# EAGLE design afb_r005_revb (EAGLE 9.6.2)
AUTHOR: Wes B; REV: 3R1

## Sheet 1 of 2
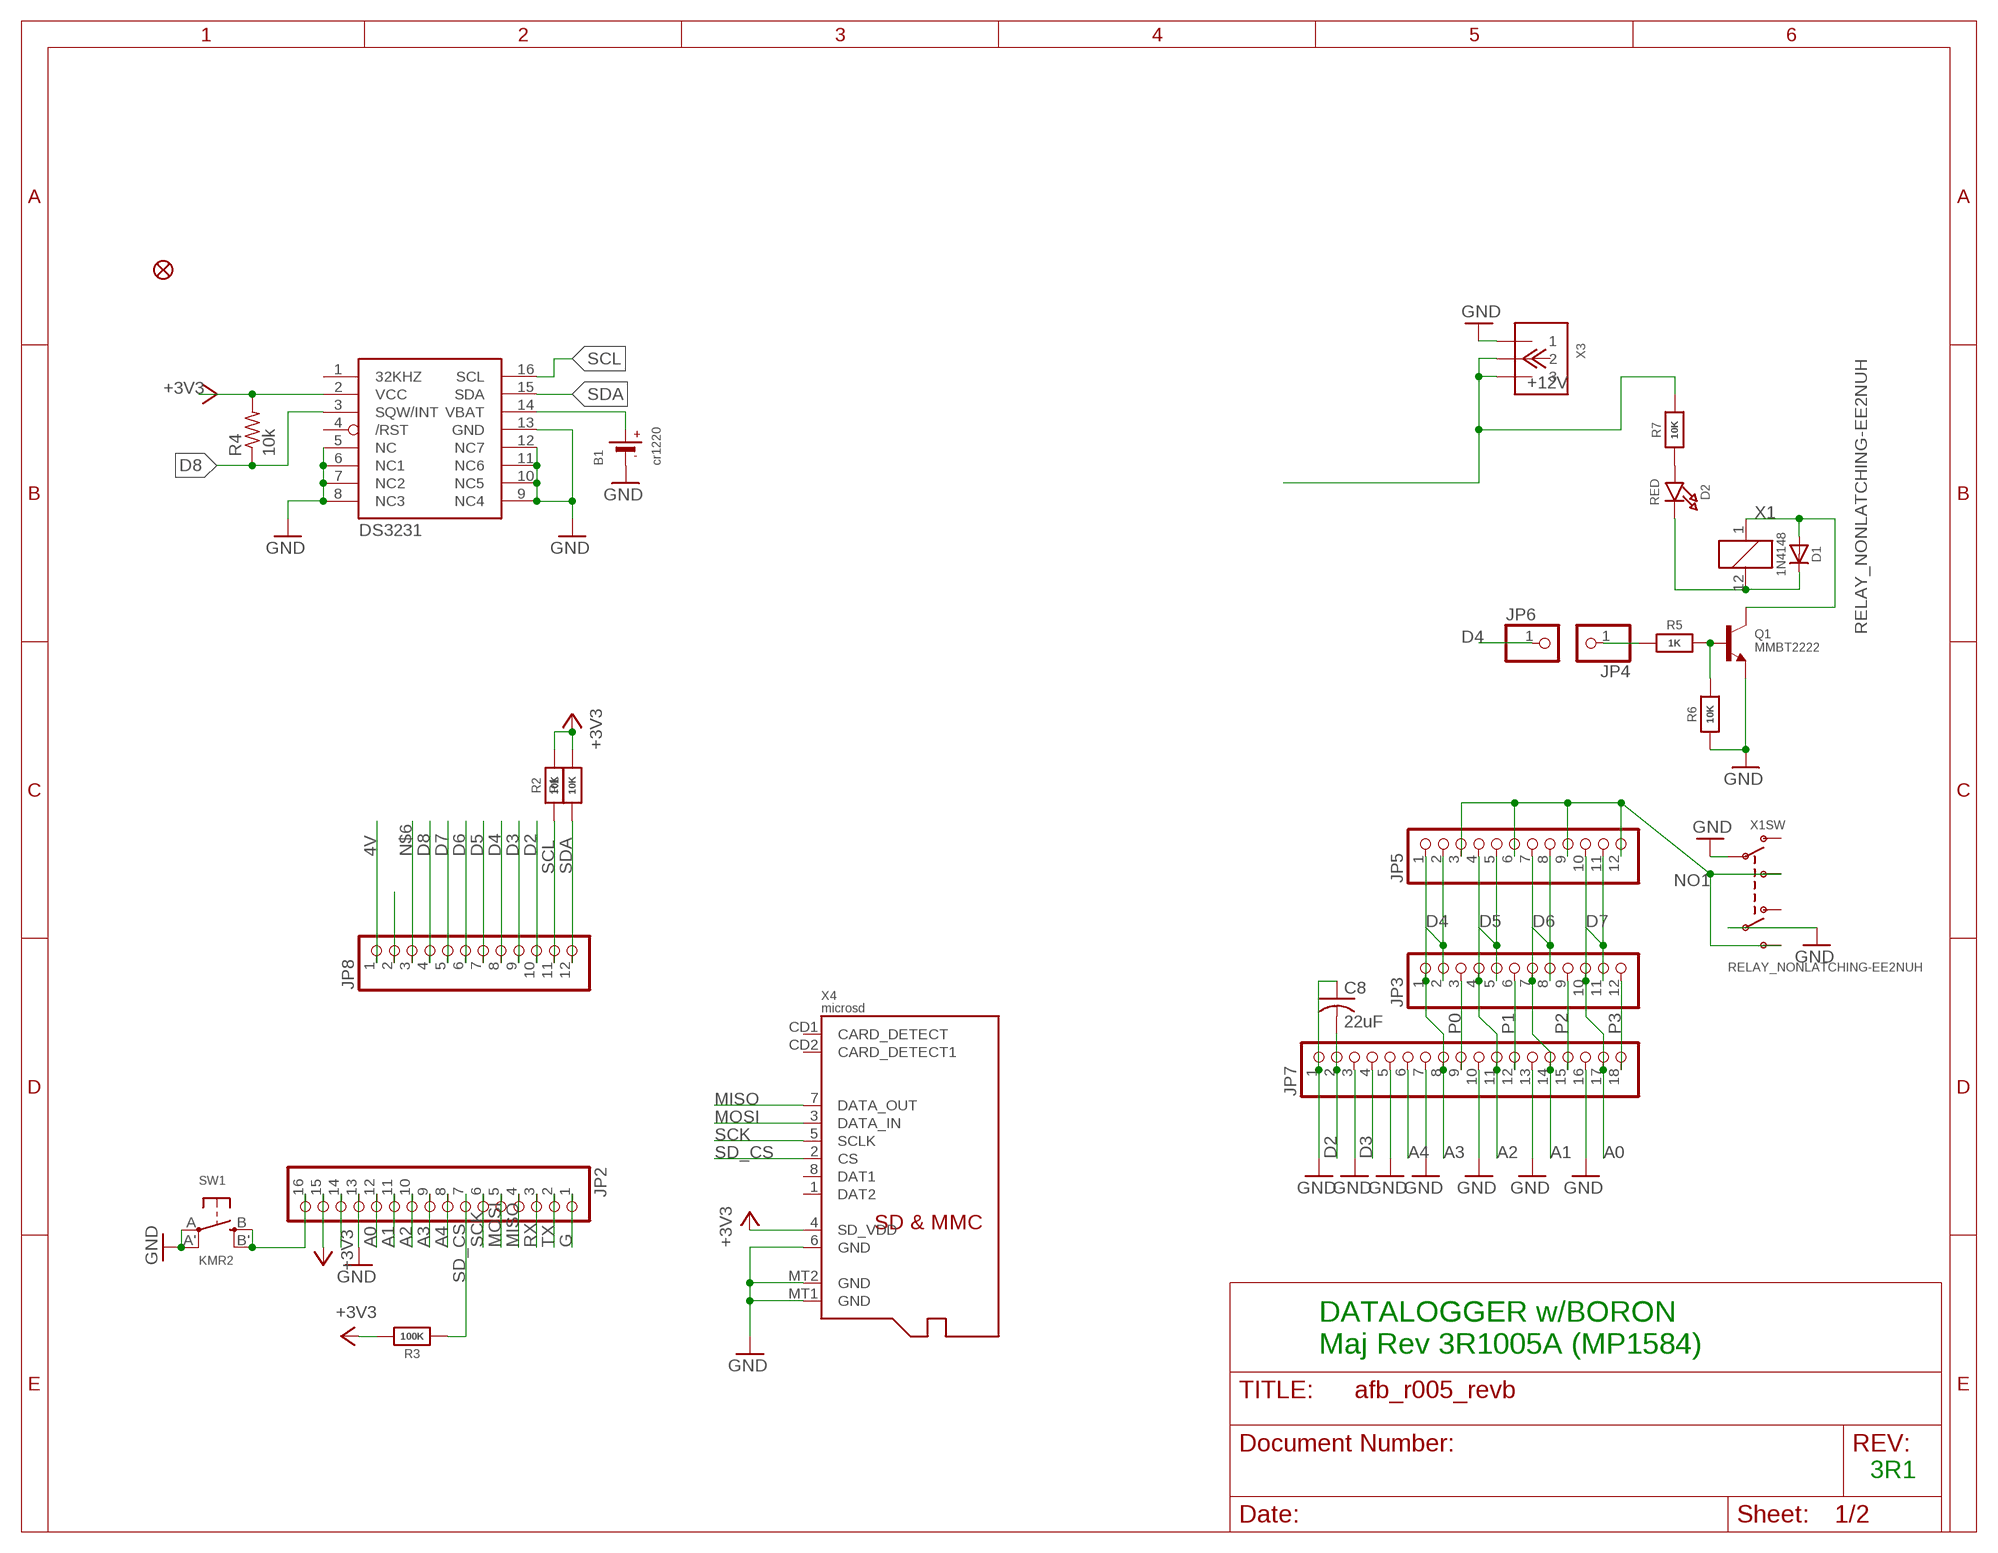
[diagram p0: schematic, sheet 1]

### Parts
B1  cr1220  BATTERYCR1220_2  [CR1220-2]
C8  22uF  C-USC0805  [C0805]
D1  1N4148  DIODESOD-323  [SOD-323]
D2  RED  LED0805_NOOUTLINE  [CHIPLED_0805_NOOUTLINE]
FID1  FIDUCIAL_1MM  [FIDUCIAL_1MM]
IC2  DS3231/SO  [SO16W]
JP2  HEADER-1X16ROUND  [1X16_ROUND]
JP3  PINHD-1X12-CB  [1X12-CB]
JP4  HEADER-1X1ROUND  [1X01_ROUND]
JP5  PINHD-1X12-CB  [1X12-CB]
JP6  HEADER-1X1ROUND  [1X01_ROUND]
JP7  PINHD-1X18  [1X18]
JP8  PINHD-1X12-CB  [1X12-CB]
Q1  MMBT2222  TRANSISTOR_NPN  [SOT23-R]
R1  10K  RESISTOR_0603_NOOUT  [0603-NO]
R2  10K  RESISTOR_0603_NOOUT  [0603-NO]
R3  100K  RESISTOR_0603_NOOUT  [0603-NO]
R4  10k  R-US_R0805  [R0805]
R5  1K  RESISTOR0805_NOOUTLINE  [0805-NO]
R6  10K  RESISTOR0805_NOOUTLINE  [0805-NO]
R7  10K  RESISTOR0805_NOOUTLINE  [0805-NO]
SW1  KMR2  SWITCH_TACT_SMT4.6X2.8  [BTN_KMR2_4.6X2.8]
X1  RELAY_NONLATCHING-EE2NUH  [RELAY_EE2_NOLATCH]
X3  TERMBLOCK_1X3  [TERMBLOCK_1X3-3.5MM]
X4  microsd  MICROSD  [MICROSD]

### Nets
4V: JP8.1 ; also sheet 2
+3V3: IC2.2(VCC) JP2.15 R1.2 R2.2 R3.2 R4.2 X4.4(SD_VDD)
A0: JP2.12 JP3.10 JP5.10 JP7.17
A1: JP2.11 JP3.7 JP5.7 JP7.14
A2: JP2.10 JP3.4 JP5.4 JP7.11
A3: JP2.9 JP3.1 JP5.1 JP7.8
A4: JP2.8 JP7.6
AREF: JP2.14
D2: C8.2 JP7.2 JP8.10
D3: JP7.4 JP8.9
D4: JP3.2 JP5.2 JP6.1 JP8.8
D5: JP3.5 JP5.5 JP8.7
D6: JP3.8 JP5.8 JP8.6
D7: JP3.11 JP5.11 JP8.5
D8: IC2.3(SQW/INT) JP8.4 R4.1
G: JP2.1
GND: B1.- C8.1 IC2.5(NC) IC2.6(NC1) IC2.7(NC2) IC2.8(NC3) IC2.9(NC4) IC2.10(NC5) IC2.11(NC6) IC2.12(NC7) IC2.13(GND) JP2.13 JP7.1 JP7.3 JP7.5 JP7.7 JP7.10 JP7.13 JP7.16 Q1.2(E) R6.1 SW1.A'(P1) SW1.A(P) X1.4(SW:P2) X1.9(SW:P1) X3.1 X4.6(GND) X4.MT1(GND) X4.MT2(GND) ; also sheet 2
MISO: JP2.4 X4.7(DATA_OUT)
MOSI: JP2.5 X4.3(DATA_IN)
N$1: B1.+ IC2.14(VBAT)
N$2: D1.A Q1.3(C) X1.1
N$6: JP8.3
N$7: JP8.2
N$11: D1.C D2.C X1.12
N$22: Q1.1(B) R5.2 R6.2
N$24: JP4.1 R5.1
N$26: D2.A R7.1
NO1 [HV]: JP5.3 JP5.6 JP5.9 JP5.12 X1.5(SW:S2) X1.8(SW:S1)
P0: JP3.3 JP7.9
P1: JP3.6 JP7.12
P2: JP3.9 JP7.15
P3: JP3.12 JP7.18
RESET: JP2.16 SW1.B'(S1) SW1.B(S)
RX: JP2.3
SCK: JP2.6 X4.5(SCLK)
SCL: IC2.16(SCL) JP8.11 R2.1
SD_CS: JP2.7 R3.1 X4.2(CS)
SDA: IC2.15(SDA) JP8.12 R1.1
TX: JP2.2
VIN: R7.2 X3.2 X3.3 ; also sheet 2
Unconnected: IC2.1(32KHZ) IC2.4(/RST) X1.3(SW:O2) X1.10(SW:O1) X4.1(DAT2) X4.8(DAT1) X4.CD1(CARD_DETECT) X4.CD2(CARD_DETECT1)

### Notes on the sheet
- DATALOGGER w/BORON
  Maj Rev 3R1005A (MP1584)
- 3R1

## Sheet 2 of 2
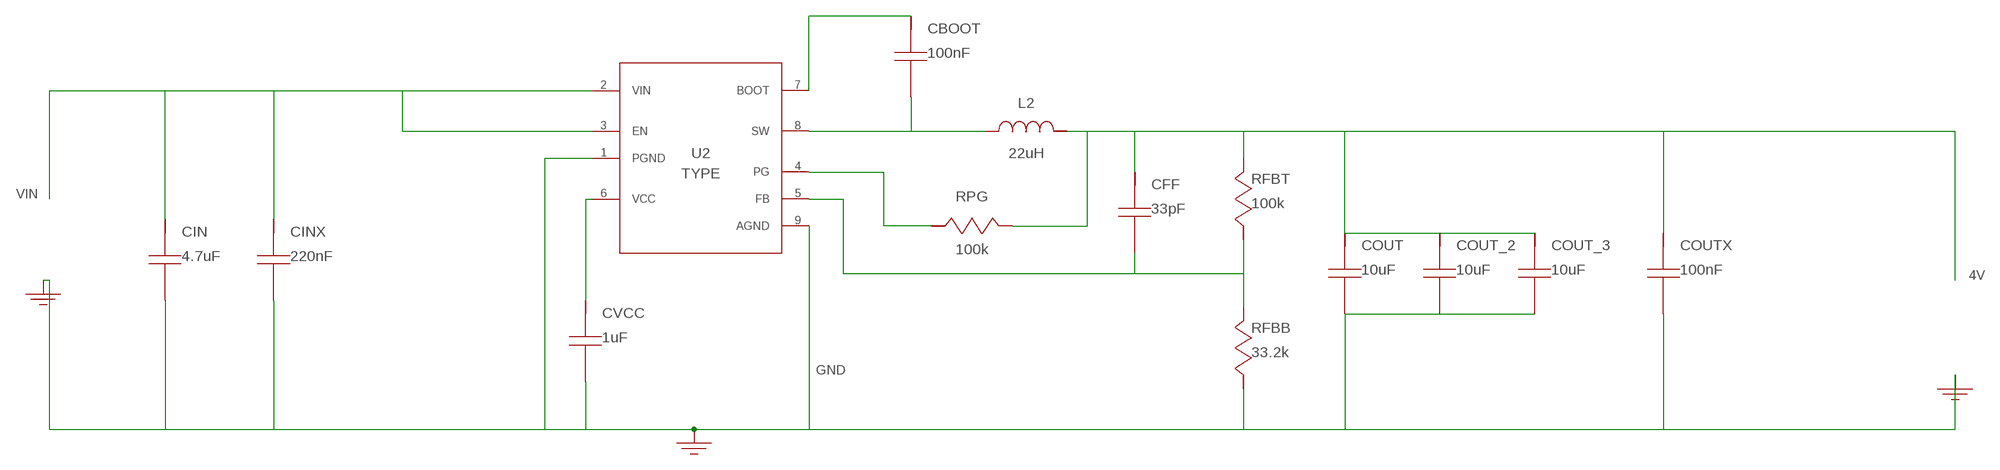
[diagram p1: schematic, sheet 2]

### Parts
CBOOT  100nF  GRM155R71C104KA88D  [0402]
CFF  33pF  CGA1A2C0G1E330J030BA  [0201]
CIN  4.7uF  GRM31CR71H475KA12L  [1206]
CINX  220nF  C2012X7R1H224K125AA  [0805]
COUT  10uF  GRM31CR60J106KA01L  [1206_190]
COUT_2  10uF  GRM31CR60J106KA01L  [1206_190]
COUT_3  10uF  GRM31CR60J106KA01L  [1206_190]
COUTX  100nF  GRM188R71C104KA01D  [0603]
CVCC  1uF  C0603C105K8PACTU  [0603]
GND  WB_GND  WB_GNDWB_GND  [WB_GND]
GND9  WB_GND  WB_GNDWB_GND  [WB_GND]
GND10  WB_GND  WB_GNDWB_GND  [WB_GND]
L2  22uH  MSS1210-223MEB  [MSS1210]
RFBB  33.2k  CRCW040233K2FKED  [0402]
RFBT  100k  CRCW0402100KFKED  [0402]
RPG  100k  CRCW0402100KFKED  [0402]
U2  Value  LMR33610ADDAR  [DDA0008J]

### Nets
4V: CFF.1 COUT.1 COUT_2.1 COUT_3.1 COUTX.1 L2.2 RFBT.1 RPG.1 ; also sheet 1
BS: CBOOT.1 U2.7(BOOT)
FB: CFF.2 RFBB.1 RFBT.2 U2.5(FB)
GND: CIN.2 CINX.2 COUT.2 COUT_2.2 COUT_3.2 COUTX.2 CVCC.2 GND9.1 GND10.1 GND.1 RFBB.2 U2.1(PGND) U2.9(AGND) ; also sheet 1
RB2: RPG.2 U2.4(PG)
VCC: CVCC.1 U2.6(VCC)
VIN: CIN.1 CINX.1 U2.2(VIN) U2.3(EN) ; also sheet 1
VSW: CBOOT.2 L2.1 U2.8(SW)

## Library data of the parts
B1 = microbuilder:BATTERY: CR1220 SMT - Digikey: 3001K-ND CD2032 BAT-HLD-001 - Digikey: BAT-HLD-001-ND
C8 = adafruit:C-US: CAPACITOR, American symbol
CBOOT = AcceleratedDesigns_Lib:GRM155R71C104KA88D; CAP: 1.0E7; ESR: 0.0; IRMS: 0.0; MANUFACTURER_NAME: MuRata; MANUFACTURER_PART_NUMBER: GRM155R71C104KA88D; VDC: 16.0; VENDOR: MuRata
CFF = AcceleratedDesigns_Lib:CGA1A2C0G1E330J030BA; CAP: 3.3E11; DATASHEETURL: httpproduct.tdk.comcapacitormlccendocumentsmlcc%5Fautomotive%5Fgeneral%5Fen.pdf; ESR: 0.0; IRMS: 0.0; MANUFACTURER_NAME: TDK; MANUFACTURER_PART_NUMBER: CGA1A2C0G1E330J030BA; VDC: 25.0; VENDOR: TDK
CIN = AcceleratedDesigns_Lib:GRM31CR71H475KA12L; CAP: 4.7E6; ESR: 0.0; IRMS: 0.0; MANUFACTURER_NAME: MuRata; MANUFACTURER_PART_NUMBER: GRM31CR71H475KA12L; VDC: 50.0; VENDOR: MuRata
CINX = AcceleratedDesigns_Lib:C2012X7R1H224K125AA; CAP: 2.2E7; DATASHEETURL: httpsproduct.tdk.comensearchcapacitorceramicmlccinfo?part%5Fno%3DC2012X7R1H224K125AA; ESR: 0.016949; IRMS: 1.59611; MANUFACTURER_NAME: TDK; MANUFACTURER_PART_NUMBER: C2012X7R1H224K125AA; VDC: 50.0; VENDOR: TDK
COUT COUT_2 COUT_3 = AcceleratedDesigns_Lib:GRM31CR60J106KA01L; CAP: 1.0E5; ESR: 0.0; IRMS: 0.0; MANUFACTURER_NAME: MuRata; MANUFACTURER_PART_NUMBER: GRM31CR60J106KA01L; VDC: 6.3; VENDOR: MuRata
COUTX = AcceleratedDesigns_Lib:GRM188R71C104KA01D; CAP: 1.0E7; ESR: 0.0; IRMS: 0.0; MANUFACTURER_NAME: MuRata; MANUFACTURER_PART_NUMBER: GRM188R71C104KA01D; VDC: 16.0; VENDOR: MuRata
CVCC = AcceleratedDesigns_Lib:C0603C105K8PACTU; CAP: 1.0E6; ESR: 0.0; IRMS: 0.0; MANUFACTURER_NAME: Kemet; MANUFACTURER_PART_NUMBER: C0603C105K8PACTU; VDC: 10.0; VENDOR: Kemet
D1 = microbuilder:DIODE: Diode SMA Model Volts Amps Type Vf Ir Digikey # Notes SSA34-E3 40V 3A Schottky 480mV @ 3A 200uA @ 40V SSA34-E3/61TGITR-ND CDBA120-G 20V 1A Schottky 500mV @ 1A 500uA @ 20V 641-1014-6-ND REEL MBRA210 10V 2A Schottky 350mV @ 2A 700uA @ 10V MBRA210LT3 SOD-123 Model Volts Amps Type Vf Ir Order # Notes BAT54T1G 30V 200mA Schottky 800mV @ 200mA 2uA @ 25V BAT54T1GOSTR-ND B0530W 30V 500mA Schottky 430mV @ 500mA 130uA @ 30V B0530W-FDICT-ND REEL MBR120 20V 1A Schottky 340mV @ 1A MBR120VLSFT1GOSCT-ND SOD-323 Model Volts Amps Type Vf Ir Order # Notes PMEG2005EJ 20V 500mA Schottky 355mV @ 500mA 568-4110-1-ND ZLLS410 10V 570mA Schottky 380mV @ 570mA ZLLS410CT-ND 1N4148WS 75V 150mA Silicon/Simple 1V 1N4148WSFSCT-ND REEL SOD-523 Model Volts Amps Type Vf Ir Order # Notes BAT54XV2 30V 200mA Schottky 0.8V @ 100mA BAT54XV2CT-ND TB751S 30V 30mA Schottky RB751S-40TE61CT-ND SOT23-R/W (R = Solder Paste/Reflow Ovens, W = Hand-Soldering) Model Volts Amps Type Vf Ir Order # Notes BAT54FILM 40V 300mA Schottky 497-7162-1-ND POWERDI-5 Model Volts Amps Type Vf Ir Order # Notes PDS560 60V 5A Schottky 670mV @ 5A 150uA @ 60V PDS560DICT-ND
D2 = microbuilder:LED: LED 0603 - 0603 Surface Mount Package 2mA: Green LED - Low Power (3.9mcd, 2ma, 1.7Vf) - Digikey: 475-2709-2-ND Orange LED - Low Power (9.8mcd, 2ma, 1.8Vf) - Digikey: 475-1194-2-ND Red LED - Low Power (5mcd, 2ma, 1.8Vf) - Digikey: 475-1195-2-ND Yellow LED - Low Power (7mcd, 2ma, 1.8Vf) - Digikey: 475-1196-2-ND 5mA: Blue LED - Low Power (17mcd, 5ma, 2.9Vf) - Digikey: LNJ937W8CRACT-ND 0805 - 0805 Surface Mount Package 2mA: Red LED (8.8mcd, 2mA, 1.8Vf, Clear) - Low Power [Digikey: 475-2510-1-ND] Green LED (5mcd, 2mA, 1.8Vf, Clear) - Low Power [Digikey: 475-2730-1-ND] Yellow LED (11.3mcd, 2mA, 1.8Vf, Clear) - Low Power [Digikey: 475-2555-1-ND] 20mA: Red LED (104mcd, 20mA, Diffused) - LS R976 [Digikey: 475-1278-6-ND] Red LED (12mcd, 20mA, 2.0Vf, Clear) - APT2012EC [Digikey: 754-1128-1-ND] Green LED (15mcd, 20mA, 2.2Vf, Clear) - APT2012GC [Digikey: 754-1131-1-ND] Orange LED (160mcd, 20mA, 2.1Vf, Clear) - APT2012SECK [Digikey: 754-1130-1-ND] 1206 - 1206 Surface Mount Package Green LED (26mcd, 20mA, Diffused) - LG N971 [Digikey: 475-1407-6-ND] Red LED (15mcd, 20mA, Diffused) - LH N974 [Digikey: 475-1416-6-ND] Cree - Cree High-Power Surface Mount LEDs XPEBWT-L1-0000-00D50 - White 111lm 350mA 2.9Vf 6200K 110° XTEAWT-00-0000-00000LEE3 - White 114lm 350mA 2.85Vf 5000K 115° Everlight - Everlight 45-21 Series Surface Mount LEDs 45-21/QK2C-B2832AC2CB2/2T - Warm White 2000mcd 20mA 3.25Vf 3050K 120° 45-21/LK2C-B38452C4CB2/2T - Nuetral White 2000mcd 20mA 3.25Vf 4150K 120° 45-21/LK2C-B50634C6CB2/2T - Cold White 2200mcd 20mA 3.25Vf 5650K 120° PLCC2 Reverse Mount LS T77K-J1L2-1-0-2-R18-Z - Red 11.25mcd 2mA 1.8Vf 630nm 120° LO T77K-L1M2-24-Z - Orange 19.6mcd 2mA 1.8Vf 606nm 120° LY T77K-K2M1-26-Z - Yellow 15.7mcd 2mA 1.8Vf 587nm 120°
FID1 = microbuilder:FIDUCIAL: Fiducial Alignment Points Various fiducial points for machine vision alignment.; BOM: EXCLUDE
GND GND9 GND10 = AcceleratedDesigns_Lib:WB_GND; MANUFACTURER_NAME: WB_GND; MANUFACTURER_PART_NUMBER: WB_GND; POWERPORTTYPE: POWER_GROUND; VALUE: Value
IC2 = DS3231:DS3231; AVAILABILITY: Unavailable; DESCRIPTION: Real Time Clock (RTC) IC Clock/Calendar I²C, 2-Wire Serial 16-SOIC (0.295, 7.50mm Width); MF: Maxim Integrated; MP: DS3231; PACKAGE: SOIC-16 Maxim Integrated; PRICE: None
JP2 = microbuilder:HEADER-1X16: PIN HEADER
JP3 JP5 JP8 = adafruit:PINHD-1X12: PIN HEADER
JP4 JP6 = microbuilder:HEADER-1X1: PIN HEADER
JP7 = adafruit:PINHD-1X18: PIN HEADER
L2 = AcceleratedDesigns_Lib:MSS1210-223MEB; DATASHEETURL: httpwww.coilcraft.compdfsmss1210.pdf; DCR: 0.026; DESCRIPTION: Unknown; IDC: 6.7; L: 2.2E5; MANUFACTURER: CoilCraft; MANUFACTURER_NAME: Coilcraft; MANUFACTURER_PART_NUMBER: MSS1210223MEB; PACKAGE_DESIGNATOR: MSS1210; VENDOR: Coilcraft
Q1 = microbuilder:TRANSISTOR_NPN: NPN Transistor Transistor (NPN) 500mA 45V - BC817 [Digikey: 568-1631-1-ND] Transistor (NPN) 500mA 45V - BC817,215 [Mouser: 771-BC817-T/R] SOT23-R - SOT23 footprint optimised for use with solder paste and reflow ovens. SOT23-W - SOT23 footprint optimised for hand-soldering (larger pads).
R1-R3 R5-R7 = microbuilder:RESISTOR: Resistors For new designs, use the packages preceded by an '_' character since they are more reliable: The following footprints should be used on most boards: _0402 - Standard footprint for regular board layouts _0603 - Standard footprint for regular board layouts _0805 - Standard footprint for regular board layouts _1206 - Standard footprint for regular board layouts For extremely tight-pitch boards where space is at a premium, the following 'micro-pitch' footprints can be used (smaller pads, no silkscreen outline, etc.): _0402MP - Micro-pitch footprint for very dense/compact boards _0603MP - Micro-pitch footprint for very dense/compact boards _0805MP - Micro-pitch footprint for very dense/compact boards _1206MP - Micro-pitch footprint for very dense/compact boards
R4 = adafruit:R-US_: RESISTOR, American symbol
RFBB = AcceleratedDesigns_Lib:CRCW040233K2FKED; MANUFACTURER_NAME: VishayDale; MANUFACTURER_PART_NUMBER: CRCW040233K2FKED; POWER: 0.063; RESISTANCE: 33200.0; TOLERANCE: 1.0; VENDOR: VishayDale
RFBT RPG = AcceleratedDesigns_Lib:CRCW0402100KFKED; MANUFACTURER_NAME: VishayDale; MANUFACTURER_PART_NUMBER: CRCW0402100KFKED; POWER: 0.063; RESISTANCE: 100000.0; TOLERANCE: 1.0; VENDOR: VishayDale
SW1 = microbuilder:SWITCH_TACT_SMT: SMT Tact Switches 6x6mm - Digikey: P12940SCT-ND KMR2 (4.6x2.8mm) - Digikey: 401-1426-1-ND EVQ-PQHB55 - Light Touch, 160GF (4.5x4.5mm) - Digikey: P8090SCT-ND KMT0 - KMT021 NGJ LHS (etc.) IP68/Waterproof - Digikey: CKN10289CT-ND
U2 = AcceleratedDesigns_Lib:LMR33610ADDAR; MANUFACTURER: Texas Instruments; MANUFACTURER_NAME: Texas Instruments; MANUFACTURER_PART_NUMBER: LMR33610ADDAR; PARTNUMBER: LMR33610ADDAR; REFDES: RefDes; TYPE: TYPE
X1 = microbuilder:RELAY_NONLATCHING
X3 = microbuilder:TERMBLOCK_1X3: 3.5mm Terminal block http://www.ladyada.net/library/pcb/eaglelibrary.html
X4 = microbuilder:MICROSD: MicroSD/Transflash Card Holder with SPI pinout 3M: 2908-05WB-MG 4UConnector: 19656 Footprint courtesy: Adafruit Industries

## Net classes
1 HV: width 0.406 mm, drill 0.381 mm, clearance 1.016 mm

## Board
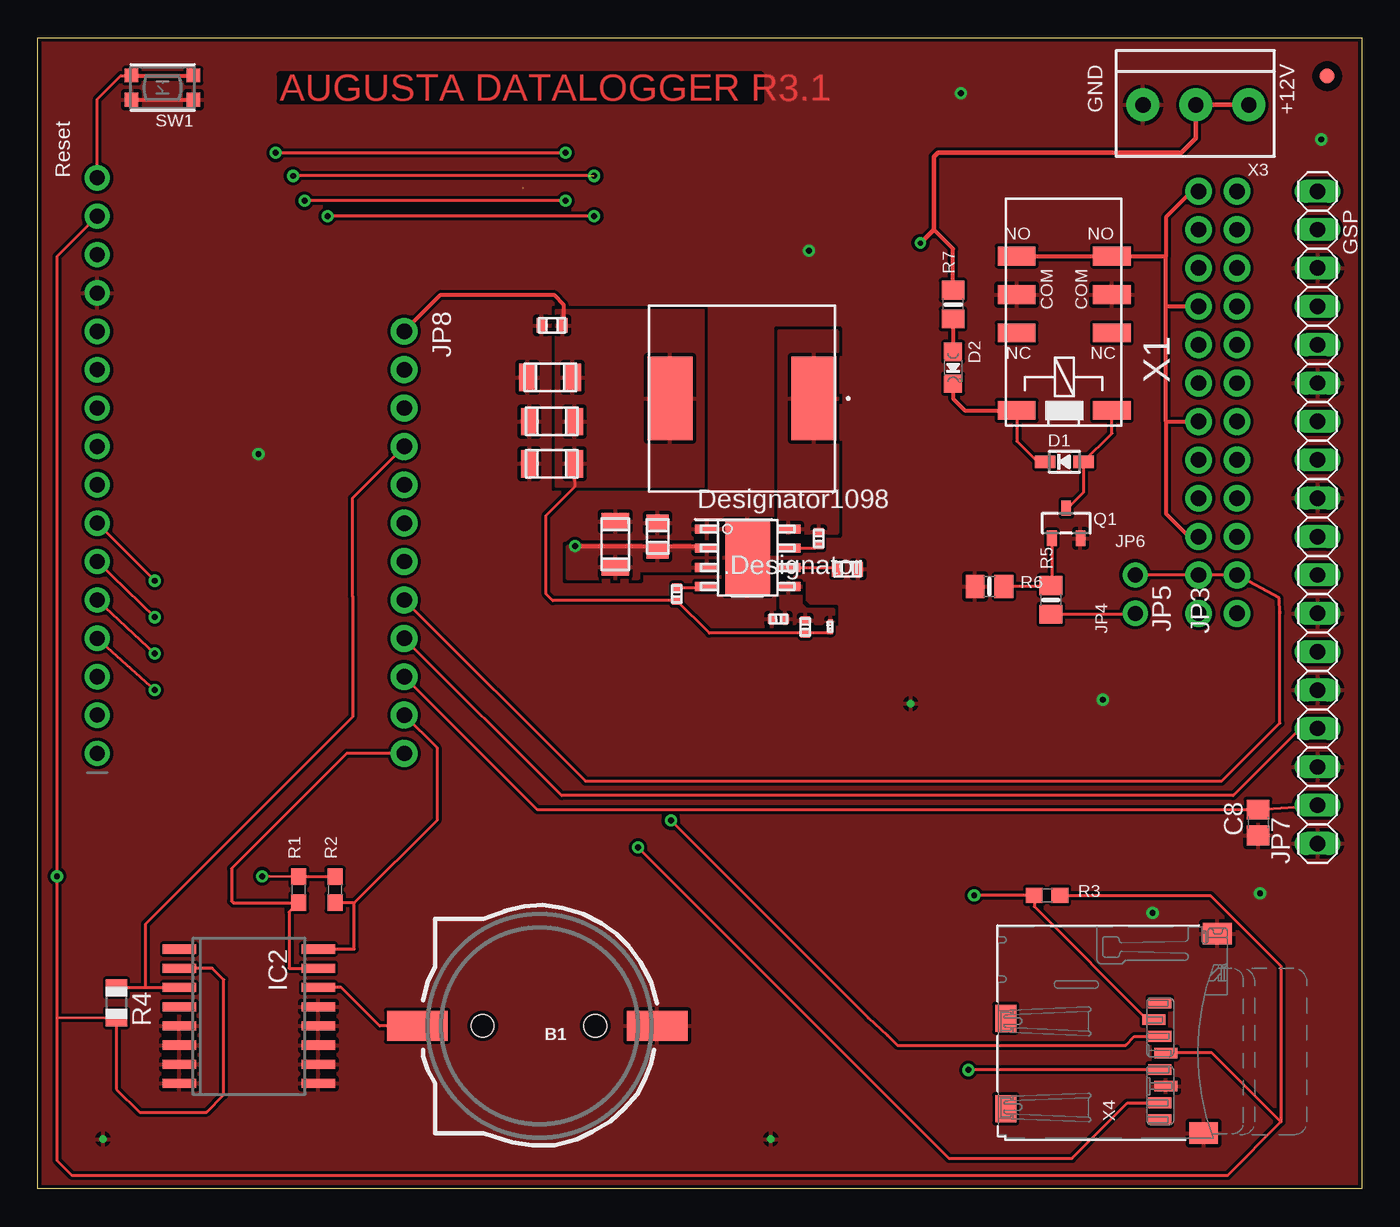
[diagram p2: board, top side]
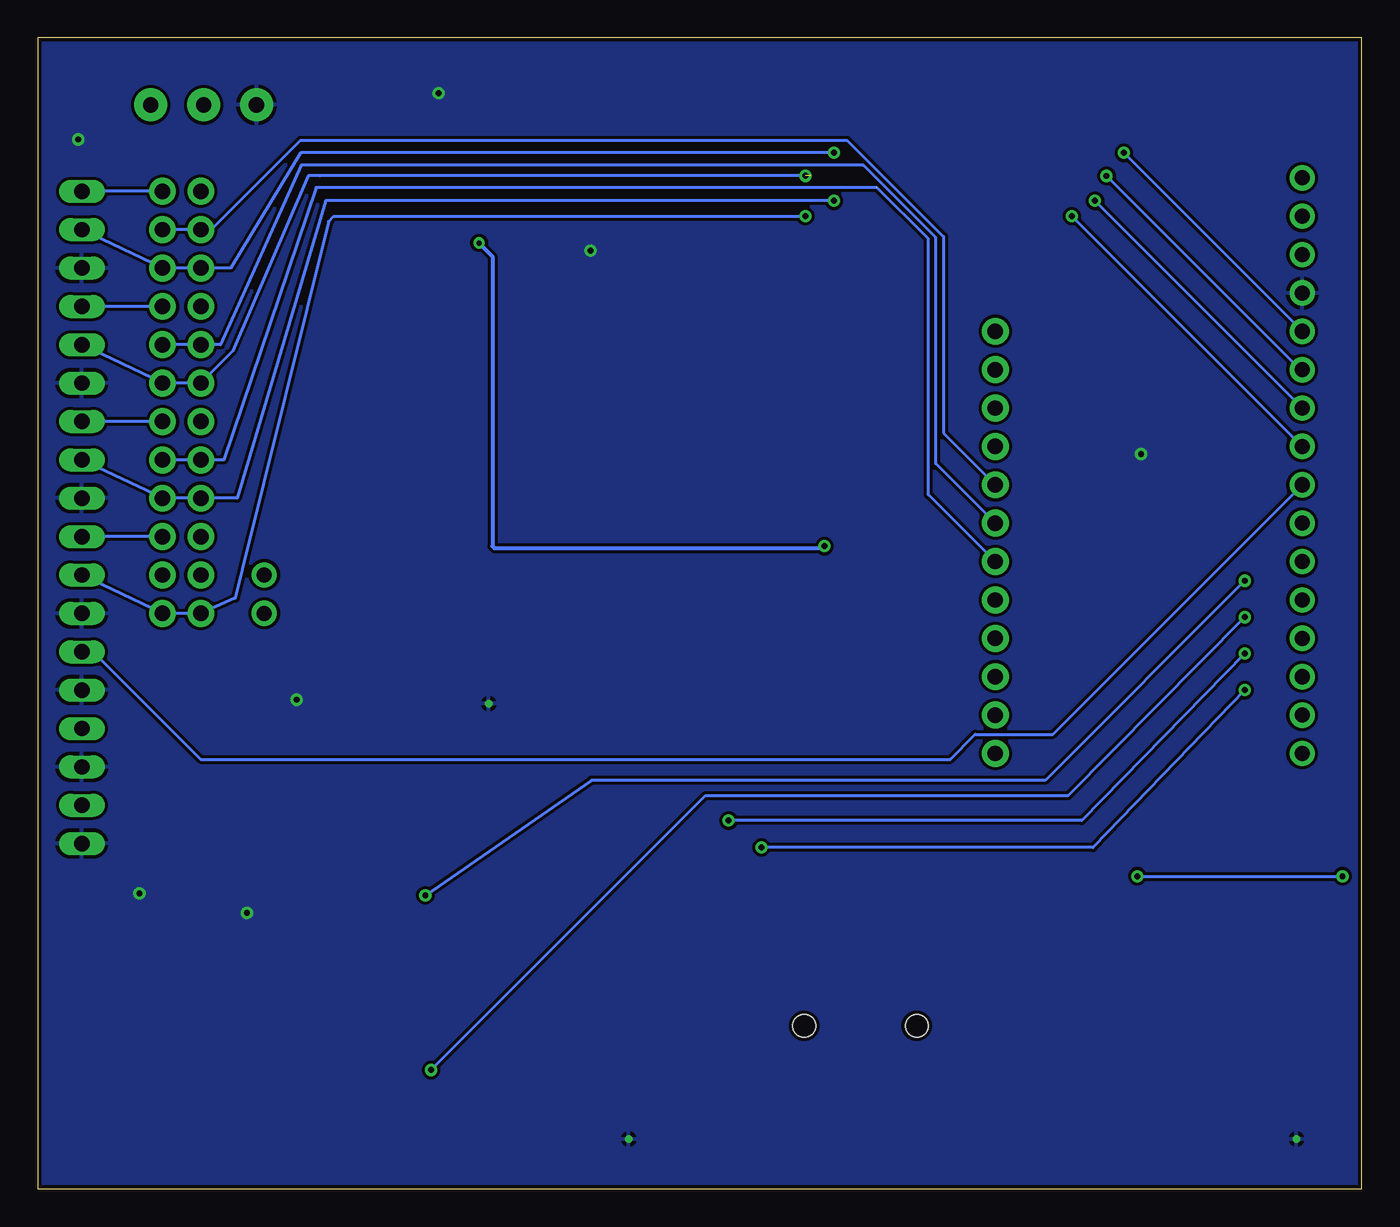
[diagram p3: board, bottom side, seen from below]

Size 87.63 x 76.2 mm. Coordinates in mm from the lower left corner, seen from the top.
Outline: 0,76.2 87.63,76.2 87.63,0 0,0 0,76.2
Copper layers (1*16): Top 0.035mm / dielectric 1.5mm / Bottom 0.035mm
Design rules "adafruit *": minimum track width 8mil, minimum drill 15.5mil, track to track 8mil, track to pad 8mil, pad to pad 8mil, via to via 8mil, smd to smd 8mil, copper to edge 10mil, drill to drill 8mil, minimum pad ring 10mil, minimum via ring 8mil, stop-mask expansion 2mil, vias tented up to drill 20mil, thermal gap 10mil

### Footprints (pad centres in the part's own frame; a part is rotated, then mirrored left to right if it is on the bottom)
CR1220-2 = smd 4 x 2: + 8.29,0; - -7.6,0 | hole 1.5: 3.95,0; -3.5,0
C0805 = smd 1.3 x 1.5: 1 -0.85,0; 2 0.85,0
0402 = smd 0.559 x 0.61: 1 -0.419,0; 2 0.419,0
0201 = smd 0.356 x 0.33: 1 -0.292,0; 2 0.292,0
1206 = smd 1.118 x 1.803: 1 -1.499,0; 2 1.499,0
0805 = smd 1.118 x 1.448: 1 -0.902,0; 2 0.902,0
1206_190 = smd 1.118 x 1.803: 1 -1.499,0; 2 1.499,0
0603 = smd 0.66 x 0.965: 1 -0.699,0; 2 0.699,0
SOD-323 = smd 1.35 x 0.8: A 1.27,0; C -1.27,0
CHIPLED_0805_NOOUTLINE = smd 1.2 x 1.2: A 0,-1.05; C 0,1.05
FIDUCIAL_1MM = smd 1 x 1: 1 0,0
WB_GND = drill 0: 1 0,0
SO16W = smd 0.6 x 2.2: 1 -4.445,-4.6; 2 -3.175,-4.6; 3 -1.905,-4.6; 4 -0.635,-4.6; 5 0.635,-4.6; 6 1.905,-4.6; 7 3.175,-4.6; 8 4.445,-4.6; 9 4.445,4.6; 10 3.175,4.6; 11 1.905,4.6; 12 0.635,4.6; 13 -0.635,4.6; 14 -1.905,4.6; 15 -3.175,4.6; 16 -4.445,4.6
1X16_ROUND = drill 1 pad 1.676: 1 -19.05,0; 2 -16.51,0; 3 -13.97,0; 4 -11.43,0; 5 -8.89,0; 6 -6.35,0; 7 -3.81,0; 8 -1.27,0; 9 1.27,0; 10 3.81,0; 11 6.35,0; 12 8.89,0; 13 11.43,0; 14 13.97,0; 15 16.51,0; 16 19.05,0
1X12-CB = drill 1.016 pad 1.778: 1 -13.97,0; 2 -11.43,0; 3 -8.89,0; 4 -6.35,0; 5 -3.81,0; 6 -1.27,0; 7 1.27,0; 8 3.81,0; 9 6.35,0; 10 8.89,0; 11 11.43,0; 12 13.97,0
1X01_ROUND = drill 1 pad 1.676: 1 0,0
1X18 = drill 1.016 long: 1 -21.59,0; 2 -19.05,0; 3 -16.51,0; 4 -13.97,0; 5 -11.43,0; 6 -8.89,0; 7 -6.35,0; 8 -3.81,0; 9 -1.27,0; 10 1.27,0; 11 3.81,0; 12 6.35,0; 13 8.89,0; 14 11.43,0; 15 13.97,0; 16 16.51,0; 17 19.05,0; 18 21.59,0
MSS1210 = smd 2.997 x 5.512: 1 -4.763,0; 2 4.763,0
SOT23-R = smd 0.635 x 1.016: 1 -0.95,-1; 2 0.95,-1; 3 0,1
0603-NO = smd 1.1 x 1: 1 -0.85,0; 2 0.85,0
R0805 = smd 1.1 x 1.4: 1 -1,0; 2 1,0
0805-NO = smd 1.24 x 1.5: 1 -0.95,0; 2 0.95,0
BTN_KMR2_4.6X2.8 = smd 0.9 x 0.9: A 2.05,0.8; A' -2.05,0.8; B 2.05,-0.8; B' -2.05,-0.8
DDA0008J = smd 1.55 x 0.6: 1 -2.7,1.905; 2 -2.7,0.635; 3 -2.7,-0.635; 4 -2.7,-1.905; 5 2.7,-1.905; 6 2.7,-0.635; 7 2.7,0.635; 8 2.7,1.905 | smd 2.95 x 4.9: 9 0,0
RELAY_EE2_NOLATCH = smd 1.25 x 2.5: 1 -6.5,-3.15; 3 -1.37,-3.15; 4 1.17,-3.15; 5 3.71,-3.15; 8 3.71,3.15; 9 1.17,3.15; 10 -1.37,3.15; 12 -6.5,3.15
TERMBLOCK_1X3-3.5MM = drill 1 pad 2.184: 1 3.55,0; 2 0.05,0; 3 -3.45,0
MICROSD = smd 0.7 x 1.5: 1 9,-10.64; 2 7.9,-10.24; 3 6.8,-10.64; 4 5.7,-11.04; 5 4.6,-10.64; 6 3.5,-11.04; 7 2.4,-10.64; 8 1.3,-10.64 | smd 1.8 x 1.4: CD1 2,-0.44; CD2 8,-0.44 | smd 1.4 x 1.9: MT1 0.4,-13.54; MT2 13.6,-14.44

### Placement (x,y rotation side)
B1  33.4,10.79 180 top
C8  80.77,24.26 90 top
CBOOT  51.69,43.05 90 top
CFF  52.45,37.21 90 top
CIN  38.23,42.67 90 top
CINX  41.02,43.18 90 top
COUT  33.91,53.72 180 top
COUT_2  34.04,48.01 180 top
COUT_3  34.04,50.8 180 top
COUTX  34.04,57.15 180 top
CVCC  53.59,41.02 0 top
D1  67.94,48.13 0 top
D2  60.58,54.36 180 top
FID1  85.34,73.66 0 top
GND  57.78,32.13 0 top
GND9  4.32,3.3 0 top
GND10  48.51,3.3 0 top
IC2  13.97,11.43 270 top
JP2  3.94,47.88 90 top
JP3  79.38,52.07 90 top
JP4  72.64,38.1 90 top
JP5  76.83,52.07 90 top
JP6  72.64,40.64 0 top
JP7  84.71,44.45 90 top
JP8  24.26,42.8 270 top
L2  46.61,52.32 180 top
Q1  68.07,44.07 0 top
R1  17.27,19.81 90 top
R2  19.68,19.81 90 top
R3  66.8,19.43 0 top
R4  5.21,12.32 270 top
R5  67.06,38.99 90 top
R6  62.99,39.88 0 top
R7  60.58,58.55 90 top
RFBB  49.02,37.72 180 top
RFBT  50.8,37.21 90 top
RPG  42.29,39.37 90 top
SW1  8.26,72.9 180 top
U2  46.99,41.78 0 top
X1  67.94,58.04 90 top
X3  76.71,71.75 180 top
X4  63.63,3.3 90 top

### Tracks (layer width: path | path; a pad name or v marks a point on that pad's centre or on a via)
4V
  Top 0.203: CFF.1 52.45,36.79 RFBT.1 44.45,36.79 RPG.1 34.07,38.95 33.66,39.37 33.66,44.58 35.56,46.48 35.56,47.98 COUT_2.1 | 34.8,57.21 COUTX.1
  Top 0.254: JP8.1 26.67,59.18 34.16,59.18 34.8,58.55 34.8,57.21
  pour Top (isolate 0.406): 44.07,46.48 44.07,58.17 34.29,58.17 34.29,46.48
+3V3  (via drill 0.39)
  Top 0.203: 1.27,11.3 v1.27,20.7 1.27,61.72 JP2.15 | 1.27,11.3 1.27,1.91 2.29,0.89 78.74,0.89 82.28,4.43 | X4.4 77.72,9 82.28,4.43 | R3.2 77.62,19.43 82.28,14.77 82.28,4.43 | 1.27,11.3 R4.2 5.21,6.6 6.73,5.08 11.18,5.08 12.32,6.22 12.32,13.84 11.56,14.61 IC2.2 | R2.2 R1.2 v14.86,20.7
  Bottom 0.203: v14.86,20.7 v1.27,20.7
A0  (via drill 0.39)
  Top 0.203: v15.75,68.58 v34.92,68.58
  Bottom 0.203: JP7.17 JP3.10 JP5.10 74.85,60.96 70.23,68.58 v34.92,68.58 | JP2.12 v15.75,68.58
A1  (via drill 0.39)  (2 unrouted)
  Top 0.203: 36.45,67.06 v16.89,67.06
  Bottom 0.203: JP7.14 JP3.7 JP5.7 74.73,55.44 69.72,67.06 68.96,67.06 | v16.89,67.06 4.06,54.23 JP2.11 | v36.83,67.06 68.96,67.06 | 68.96,67.06
A2  (via drill 0.39)
  Top 0.203: v34.92,65.41 v17.65,65.41
  Bottom 0.203: v34.92,65.41 68.58,65.41 74.45,45.72 JP5.4 JP3.4 JP7.11 | JP2.10 v17.65,65.41
A3  (via drill 0.39)
  Top 0.203: v36.83,64.39 v19.18,64.39
  Bottom 0.203: JP2.9 v19.18,64.39 | JP7.8 JP3.1 JP5.1 74.55,39.12 74.09,41.01 68.39,64.04 68.04,64.39 v36.83,64.39
A4
  Bottom 0.203: JP7.6 83.95,35.56 76.83,28.45 27.24,28.45 25.59,30.1 20.45,30.1 JP2.8
BS
  Top 0.203: U2.7 51.47,42.42 CBOOT.1
D2
  Top 0.203: JP7.2 C8.2 33.06,25.11 JP8.10
D3
  Top 0.203: JP8.9 34.67,26.04 79.12,26.04 83.57,30.48 JP7.4
D4
  Top 0.203: 82.22,38.09 82.21,38.2 | 82.22,38.09 82.22,30.82 82.19,30.82 78.36,27 36.25,27 JP8.8 | 82.22,38.09 82.17,39.12 JP3.2 JP5.2 JP6.1
D5  (1 unrouted)
  Bottom 0.203: JP3.5 JP5.5 75.32,48.26 69.22,66.29 32.13,66.29 | JP8.7 28.69,45.97 28.69,62.9 32.09,66.29
D6
  Bottom 0.203: JP3.8 JP5.8 75.53,55.88 75.53,55.91 70.2,67.76 32.98,67.76 28.19,62.97 28.19,48 JP8.6
D7
  Bottom 0.203: JP3.11 JP5.11 76.15,63.5 70.24,69.41 34.06,69.41 27.68,63.04 27.68,50.04 JP8.5
D8
  Top 0.203: 9.35,13.35 IC2.3 7.11,13.34 | 7.11,13.34 5.21,13.34 R4.1 | JP8.4 20.83,45.72 20.83,39.24 20.83,31.24 7.11,17.53 7.11,13.34
FB
  pour Top (isolate 0.406): 49.15,37.34 52.7,37.34 52.7,38.35 50.93,38.35 50.55,38.73 50.55,40.13 49.15,40.13
GND  (via drill 0.39)
  Top 0.254: SW1.A SW1.A'
  other vias: 80.9,19.56 73.79,18.29 84.96,69.47 70.48,32.38 61.09,72.52 51.05,62.1 14.61,48.64
  pour Top (rank 3): 0,77.47 0,0 88.01,0 88.01,77.47
  pour Bottom: 0,77.47 0,0 88.14,0 88.14,77.47
  pour Top (isolate 0.406, rank 2): 30.99,58.17 33.4,58.17 33.66,57.91 33.66,45.34 44.58,45.34 44.58,43.31 31.24,43.31 30.61,43.94 30.61,57.78
MISO  (via drill 0.39)
  Top 0.203: 4.06,36.45 JP2.4 v7.75,33.02 | v39.73,22.61 60.31,2.03 68.45,2.03 72.12,5.7 X4.7
  Bottom 0.203: v39.73,22.61 17.78,22.61 v7.75,33.02
MOSI  (via drill 0.39)
  Top 0.203: 56.2,10.22 54.97,11.32 v41.9,24.38 | 56.2,10.22 56.26,10.16 | 56.2,10.22 56.89,9.53 72.01,9.53 72.59,10.1 X4.3 | JP2.5 v7.75,35.43
  Bottom 0.203: v7.75,35.43 18.54,24.38 v41.9,24.38
N$1
  Top 0.203: B1.+ 22.63,10.79 20.09,13.34 IC2.14
N$2
  Top 0.203: X1.1 71.09,50.01 D1.A 69.22,46.1 68.18,45.07 Q1.3
N$11
  Top 0.203: X1.12 64.8,49.51 66.17,48.13 D1.C
  Top 0.254: D2.C 60.58,52.32 61.36,51.54 X1.12
N$22
  Top 0.203: Q1.1 67.12,40.01 R5.2 67,39.88 R6.2
N$24
  Top 0.203: JP4.1 72.58,38.04 R5.1
N$26
  Top 0.254: R7.1 D2.A
NO1
  Top 0.254: X1.8 X1.5 74.68,61.75 | 74.68,50.8 74.68,58.42 | 74.68,50.8 JP5.6 | 74.68,50.8 74.68,44.7 76.2,43.18 JP5.3 | 76.39,66.04 74.68,64.32 74.68,61.75 | 74.68,58.42 74.68,61.75 | JP5.9 74.68,58.42
  Top 0.406: JP5.12 76.39,66.04
P0
  Bottom 0.203: JP3.3 JP7.9
P1
  Bottom 0.203: JP3.6 JP7.12
P2
  Bottom 0.203: JP3.9 JP7.15
P3
  Bottom 0.203: JP3.12 JP7.18
RB2
  Top 0.203: U2.4 44.29,39.79 RPG.2
RESET
  Top 0.203: JP2.16 3.94,72.14 5.5,73.7 SW1.B
  Top 0.254: SW1.B SW1.B'
SCK  (via drill 0.39)
  Top 0.203: X4.5 74.24,7.87 v61.59,7.87 | JP2.6 v7.75,37.85
  Bottom 0.203: v7.75,37.85 19.43,26.04 43.43,26.04 v61.59,7.87
SCL
  Top 0.203: JP8.11 26.42,29.21 26.42,24.38 20.95,18.92 | R2.1 19.72,18.92 20.95,18.92 | IC2.16 20.95,15.88 20.95,18.92
SD_CS  (via drill 0.39)
  Top 0.203: v61.98,19.43 R3.1 65.95,18.7 73.45,11.2 X4.2 | JP2.7 v7.75,40.26
  Bottom 0.203: v61.98,19.43 50.99,27.05 20.95,27.05 v7.75,40.26
SDA
  Top 0.203: JP8.12 20.45,28.83 12.83,21.21 12.83,19.05 12.95,18.92 17.23,18.92 R1.1 16.64,18.33 16.64,14.61 IC2.15
VCC
  Top 0.203: U2.6 52.77,41.15 CVCC.1
VIN  (via drill 0.35, 0.39)
  Top 0.203: 44.16,42.55 U2.2
  Top 0.254: R7.2 60.58,62.23 59.31,63.5 | v35.56,42.55 44.16,42.55
  Top 0.305: X3.3 X3.2 76.66,69.55 75.69,68.58 59.56,68.58 59.31,68.33 59.31,63.5 v58.42,62.61
  Bottom 0.203: 35.69,42.42 v35.56,42.55
  Bottom 0.254: v58.42,62.61 57.53,61.72 57.53,42.55 57.4,42.42 35.69,42.42
  pour Top (isolate 0.406): 45.09,42.67 45.09,40.89 39.75,40.89 39.75,40.77 39.75,40.39 35.05,40.39 35.05,41.02 35.05,42.55 35.31,42.55 35.31,42.67 35.43,42.67
VSW
  pour Top (isolate 0.406): 49.02,43.43 52.96,43.43 52.96,56.77 49.02,56.77

### Text on the board
Top: AUGUSTA DATALOGGER R3.1
tPlace: GND | +12V | Reset | GSP